# Altium schematic sheet Power_Pcb.SchDoc
size A; SheetNumber: 1; SheetTotal: 1
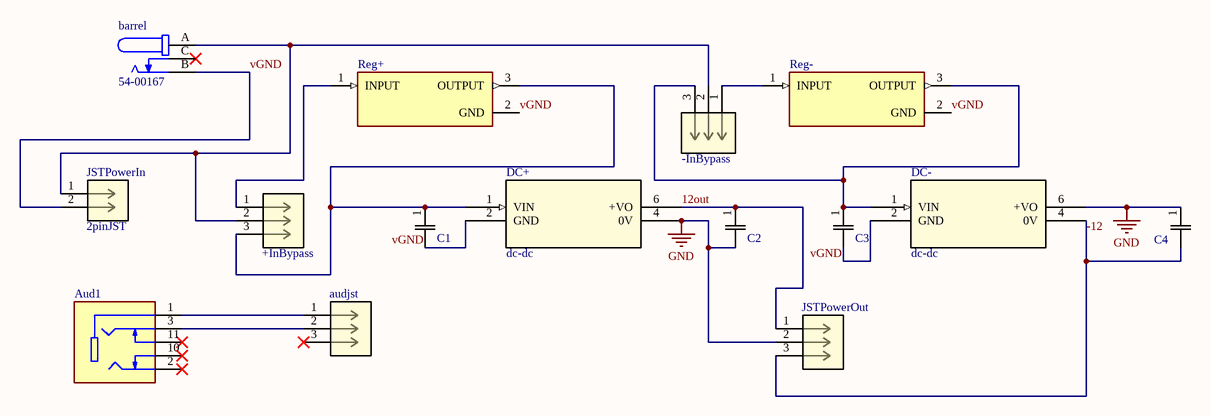
[diagram p0: Power_Pcb.SchDoc]

## Parts
+InBypass  3pinHeaders  [CONN_M20-99903XX_HRW]  (value not drawn)
-InBypass  3pinHeaders  [CONN_M20-99903XX_HRW]  (value not drawn)
Aud1  Audioport  [CUI_SJ1-3525N]  (value not drawn)
audjst  3pinHeaders  [CONN_M20-99903XX_HRW]  (value not drawn)
barrel  54-00167  [TENSILITY_54-00167]
C1  capacitor  [CAP_YX_6P3X11_RUB]  (value not drawn)
C2  capacitor  [CAP_YX_6P3X11_RUB]  (value not drawn)
C3  capacitor  [CAP_YX_6P3X11_RUB]  (value not drawn)
C4  capacitor  [CAP_YX_6P3X11_RUB]  (value not drawn)
DC+  dc-dc  [B_S-2WR2_MNS]
DC-  dc-dc  [B_S-2WR2_MNS]
JSTPowerIn  2pinJST  [CONN_B2B-XH-A_JST]
JSTPowerOut  3pinJST  [CONN_B3B-XH-A_JST]  (value not drawn)
Reg+  +10vregulator  [TO255P1020X450X1968-3B]  (value not drawn)
Reg-  +10vregulator  [TO255P1020X450X1968-3B]  (value not drawn)

## Nets
GND: C2.2 C4.1 DC+.4(0V) DC-.6(+VO) JSTPowerOut.2
12out: C2.1 DC+.6(+VO) JSTPowerOut.1
-12: C4.2 DC-.4(0V) JSTPowerOut.3
vGND: barrel.B C1.2 C3.2 DC+.2(GND) DC-.2(GND) JSTPowerIn.2 Reg+.2(GND) Reg-.2(GND)
Net+InBypass_1: +InBypass.1 Reg+.1(INPUT)
Net+InBypass_2: +InBypass.2 -InBypass.2 barrel.A JSTPowerIn.1
Net+InBypass_3: +InBypass.3 C1.1 DC+.1(VIN) Reg+.3(OUTPUT)
Net-InBypass_1: -InBypass.1 Reg-.1(INPUT)
Net-InBypass_3: -InBypass.3 C3.1 DC-.1(VIN) Reg-.3(OUTPUT)
NetAud1_1: Aud1.1 audjst.1
NetAud1_3: Aud1.3 audjst.2

Not connected (* = marked no-connect by the designer): Aud1 2* 10* 11*; audjst 3*; barrel C*

## Library data of the parts
+InBypass -InBypass audjst = 3pinHeaders: No Description Available; Mfr_Name: Harwin; RefDes: RefDes; Type: Type
Aud1 = Audioport: 3.5 mm, Stereo, Right Angle, Through Hole, 3 Conductors, 2 Internal Switches, Audio Jack Connector; MF: CUI Devices; MP: SJ1-3525N; SnapEDA_Link: https://www.snapeda.com/parts/SJ1-3525N/CUI+Devices/view-part/?ref=snap; Package: None; Value: *; CUI_purchase_URL: https://www.cuidevices.com/product/interconnect/connectors/audio-connectors/jacks/sj1-3525n?utm_source=snapeda.com&utm_medium=referral&utm_campaign=snapedaBOM; Check_prices: https://www.snapeda.com/parts/SJ1-3525N/CUI+Devices/view-part/?ref=eda
barrel = 54-00167: Connector, dc jack 5.5x2.5 mm, PCB mount, 90 degrees, nickel plated, PBT, thru hole; MF: Tensility International Corp; Package: None; Price: None; Check_prices: https://www.snapeda.com/parts/54-00167/Tensility+International+Corp/view-part/?ref=eda; Value: *; SnapEDA_Link: https://www.snapeda.com/parts/54-00167/Tensility+International+Corp/view-part/?ref=snap; MP: 54-00167; Availability: In Stock; Purchase-URL: https://pricing.snapeda.com/search?q=54-00167&ref=eda
C1-C4 = capacitor: No Description Available; Mfr_Name: Rubycon
DC+ DC- = dc-dc: No Description Available; Mfr_Name: MORNSUN; Type: DC DC Converters; RefDes: RefDes
JSTPowerIn = 2pinJST: No Description Available; Mfr_Name: JST; RefDes: RefDes; Type: Type
JSTPowerOut = 3pinJST: No Description Available; Mfr_Name: JST; RefDes: RefDes; Type: Type
Reg+ Reg- = +10vregulator: Linear Voltage Regulator IC Positive Fixed 1 Output 1.5A TO-220AB; MF: STMicroelectronics; MP: L7810CV; SnapEDA_Link: https://www.snapeda.com/parts/L7810CV/STMicroelectronics/view-part/?ref=snap; Package: TO-220-3 STMicroelectronics; Value: *; Check_prices: https://www.snapeda.com/parts/L7810CV/STMicroelectronics/view-part/?ref=eda